# EasyEDA Pro project 智能台灯.epro

# Schematic STC15单片机台灯
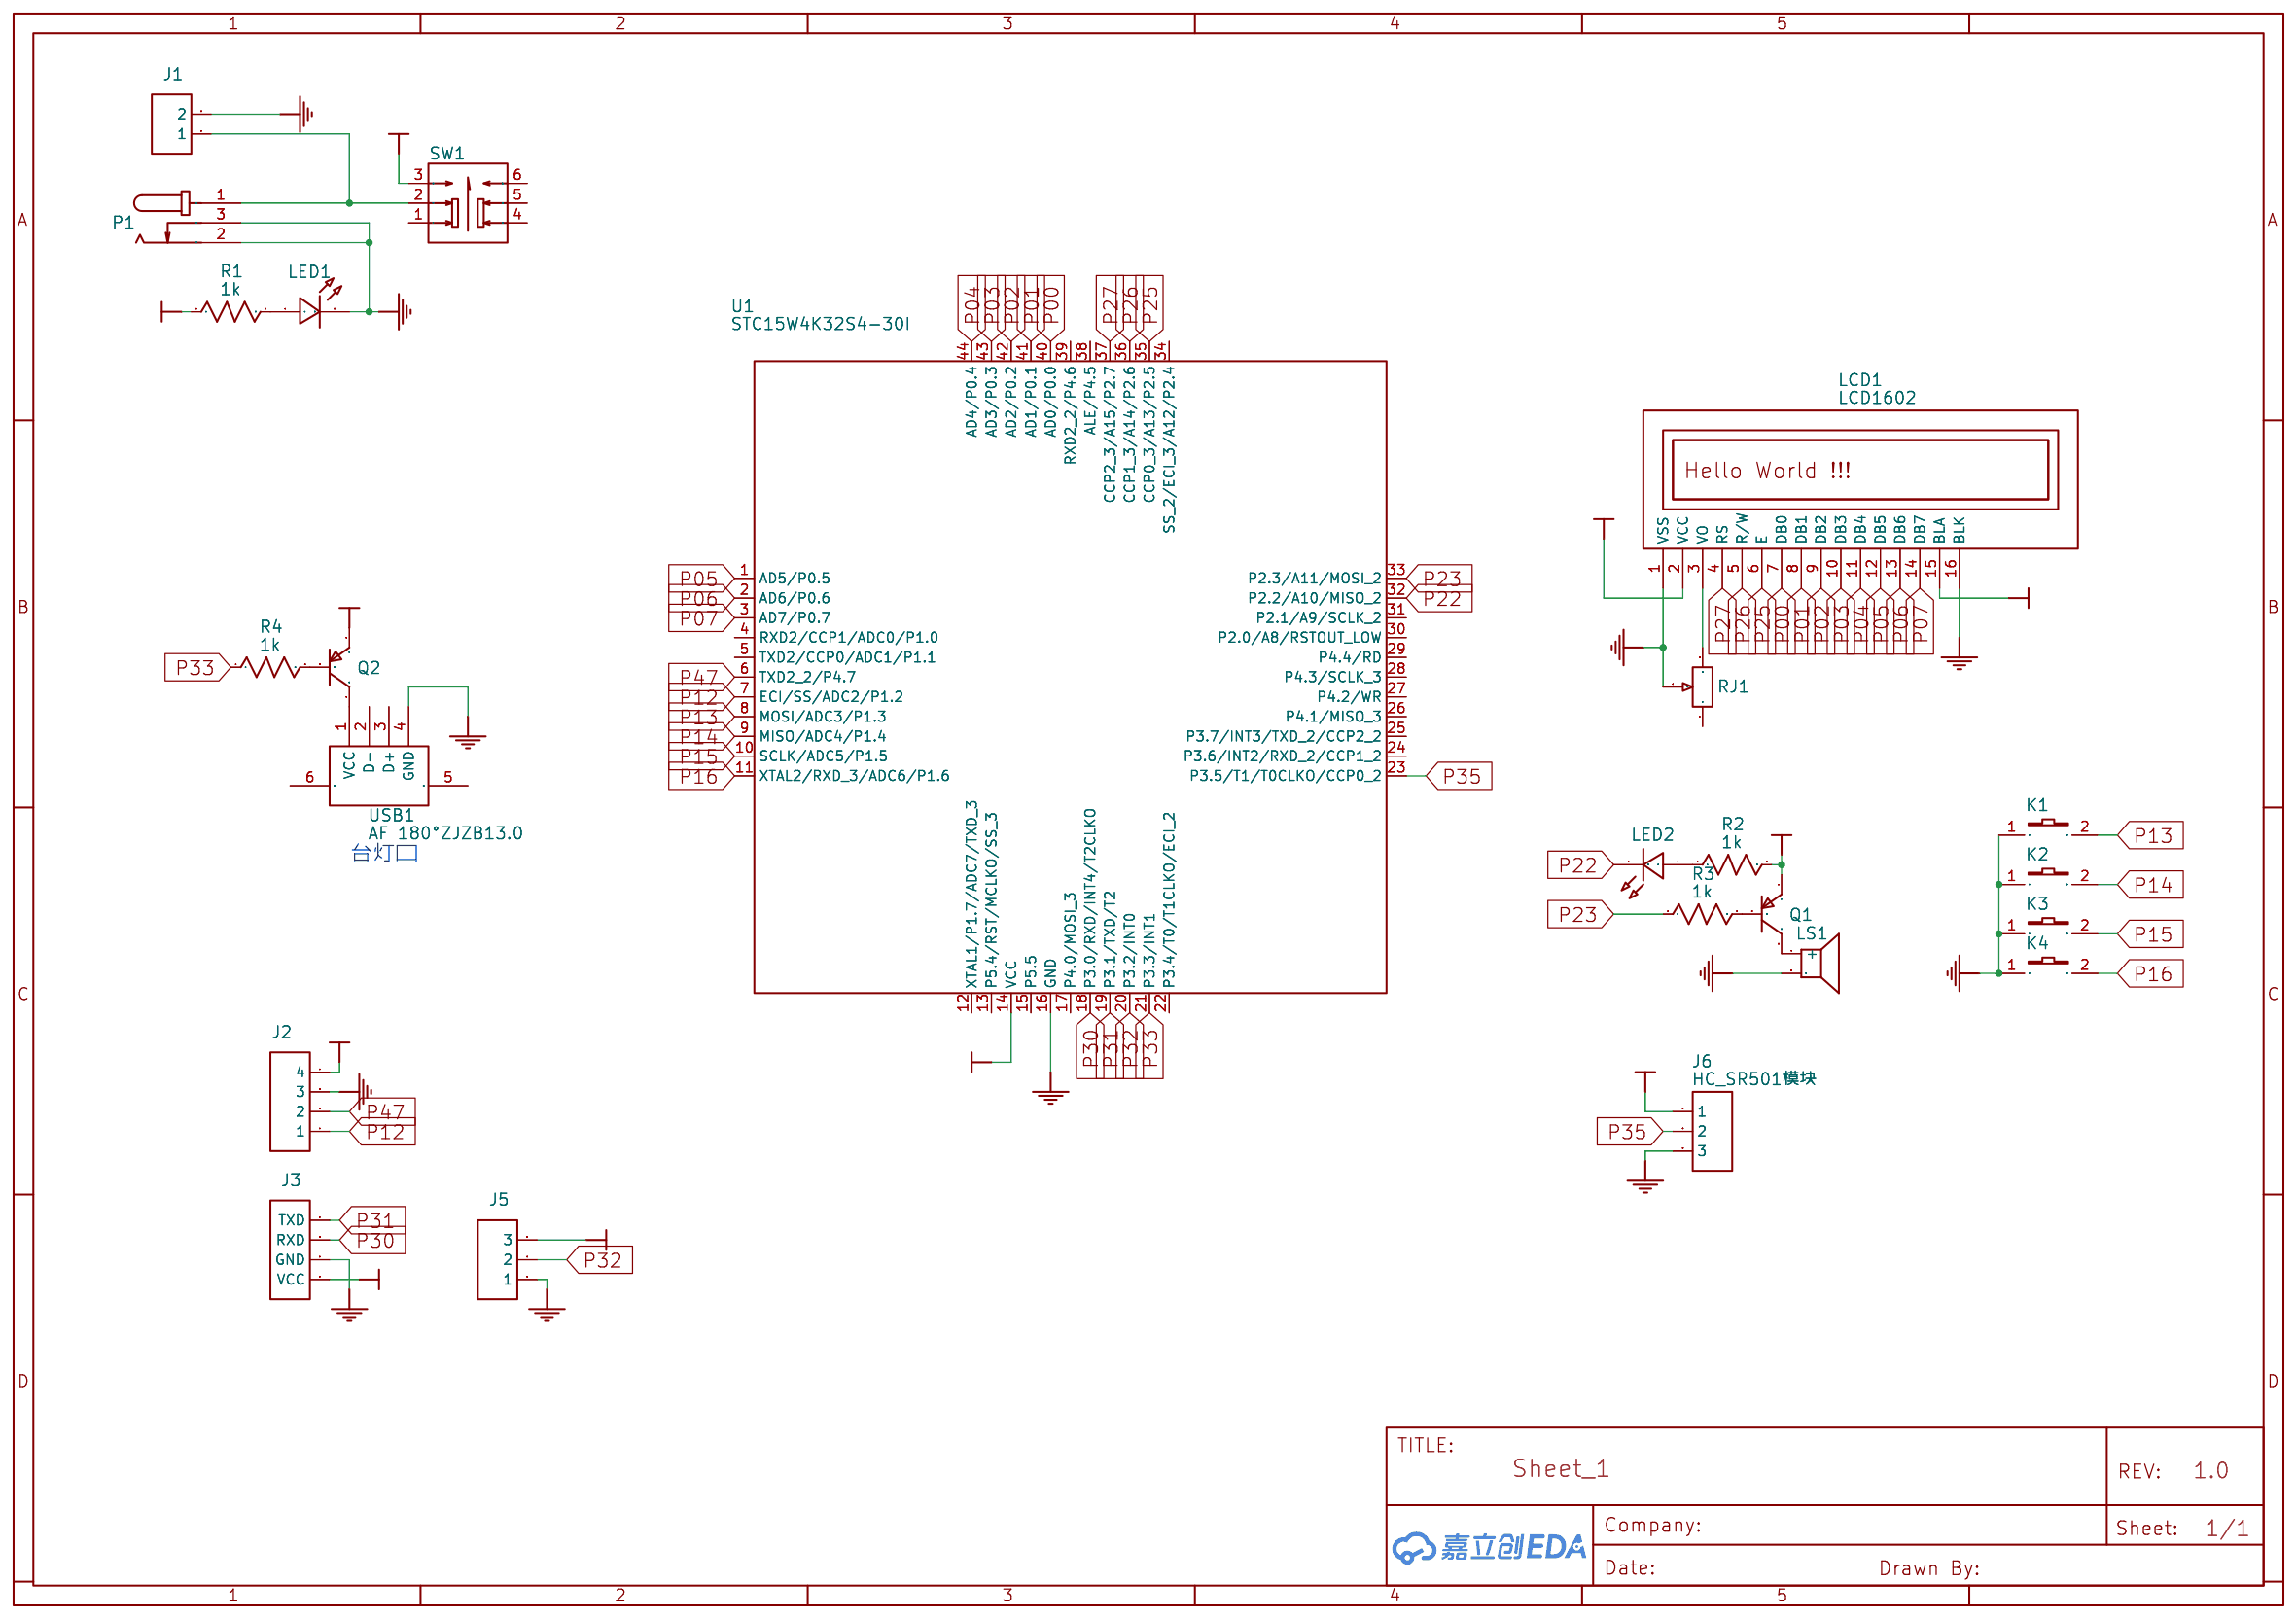
[diagram p0: schematic sheet]

## Parts
J1  HDR-F-2.54_1x2  [HDR-F-2.54_1X2]
J2  HDR-M-2.54_1x4  [HDR-M-2.54_1X4]
J3  HDR-F-2.54_1x4  [HDR-F-2.54_1X4]
J5  HDR-M-2.54_1x3  [HDR-M-2.54_1X3]
J6  HC_SR501模块  [HDR-M-2.54_1X3]
K1  K2-3.6×6.1_SMD  [BUTTON]
K2  K2-3.6×6.1_SMD  [BUTTON]
K3  K2-3.6×6.1_SMD  [BUTTON]
K4  K2-3.6×6.1_SMD  [BUTTON]
LCD1  LCD1602  [LCD1602]
LED1  LED-0603_R  [LED]
LED2  LED-0603_R  [LED]
LS1  YS-PBZ2316DYB12  [BUZZER-9MM]
P1  DC005-2.0MM  [POWER]
Q1  SS8550_C717456  [PNP]
Q2  SS8550_C717456  [PNP]
R1  1k  [RES]
R2  1k  [RES]
R3  1k  [RES]
R4  1k  [RES]
RJ1  微调立式蓝白电位器RM063-H1-10K  [__________]
SW1  PS-5850A-6PL  [SW-TH_6P-L5.8-W5.8-P2.00-LS4.5-BL_1]
U1  STC15W4K32S4-30I  [LQFP-44_L10.0-W10.0-P0.80-LS12.0-BL]
USB1  AF 180°ZJZB13.0  [USB-A-TH_USB-AF-13.7-180-PBT]

## Library data of the parts
J1 = HDR-F-2.54_1x2: Supplier Part: C49661; Supplier: LCSC
J2 = HDR-M-2.54_1x4: Supplier Part: C124378; Supplier: LCSC
J3 = HDR-F-2.54_1x4: Supplier Part: C225501; Supplier: LCSC
J5 = HDR-M-2.54_1x3: Supplier Part: C180248; Supplier: LCSC
J6 = HC_SR501模块: Supplier Part: C180248; Supplier: LCSC
K1-K4 = K2-1107ST-A4SW-06: Supplier Part: C118141; Supplier: LCSC; 制造商: 韩国韩荣
LCD1 = LCM1602K-NSW-BBW: Manufacturer: LONTECH(厦门龙特); Supplier Part: C83275; Supplier: LCSC
LED1 LED2 = 19-217/R6C-AL1M2VY/3T: Manufacturer: EVERLIGHT(台湾亿光); Supplier Part: C72044; Supplier: LCSC
LS1 = YS-PBZ2316DYB12: Supplier: LCSC; Supplier Part: C18337451; Manufacturer: Fengming(锋鸣电子)
P1 = DC005-2.0MM: Supplier: LCSC; Manufacturer: SOFNG; Supplier Part: C111567
Q1 Q2 = SS8550: Supplier: LCSC; Supplier Part: C717456; Manufacturer: LGE(鲁光); JLCPCB Part Class: Extended Part
R1-R4 = 1k
RJ1 = 微调立式蓝白电位器RM063-H1-10K: Supplier: LCSC; Supplier Part: C9900022631; Manufacturer: null; JLCPCB Part Class: Extended Part
SW1 = PS-5850A-6PL: Supplier: LCSC; Supplier Part: C963201; Manufacturer: G-Switch; JLCPCB Part Class: Extended Part
U1 = STC15W4K32S4-30I-LQFP44: Supplier: LCSC; Manufacturer: STC(宏晶); Supplier Part: C58472; JLCPCB Part Class: Extended Part
USB1 = AF 180°ZJZB13.0: Supplier: LCSC; Supplier Part: C6081370; Manufacturer: SHOU HAN(首韩); JLCPCB Part Class: Extended Part

## Nets
GND: J1.2 J2.3 J3.2(GND) J5.1 J6.3 K1.1 K2.1 K3.1 K4.1 LCD1.1(VSS) LCD1.16(BLK) LED1.2 LS1.2 P1.2 P1.3 RJ1.2 U1.16(GND) USB1.4(GND)
VCC: J2.4 J3.1(VCC) J5.3 J6.1 LCD1.2(VCC) LCD1.15(BLA) Q1.1(E) Q2.1(E) R1.1 R2.2 SW1.3 U1.14(VCC)
P00: LCD1.7(DB0) U1.40(AD0/P0.0)
P01: LCD1.8(DB1) U1.41(AD1/P0.1)
P02: LCD1.9(DB2) U1.42(AD2/P0.2)
P03: LCD1.10(DB3) U1.43(AD3/P0.3)
P04: LCD1.11(DB4) U1.44(AD4/P0.4)
P05: LCD1.12(DB5) U1.1(AD5/P0.5)
P06: LCD1.13(DB6) U1.2(AD6/P0.6)
P07: LCD1.14(DB7) U1.3(AD7/P0.7)
P12: J2.1 U1.7(ECI/SS/ADC2/P1.2)
P13: K1.2 U1.8(MOSI/ADC3/P1.3)
P14: K2.2 U1.9(MISO/ADC4/P1.4)
P15: K3.2 U1.10(SCLK/ADC5/P1.5)
P16: K4.2 U1.11(XTAL2/RXD_3/ADC6/P1.6)
P22: LED2.2 U1.32(P2.2/A10/MISO_2)
P23: R3.1 U1.33(P2.3/A11/MOSI_2)
P25: LCD1.6(E) U1.35(CCP0_3/A13/P2.5)
P26: LCD1.5(R/W) U1.36(CCP1_3/A14/P2.6)
P27: LCD1.4(RS) U1.37(CCP2_3/A15/P2.7)
P30: J3.3(RXD) U1.18(P3.0/RXD/INT4/T2CLKO)
P31: J3.4(TXD) U1.19(P3.1/TXD/T2)
P32: J5.2 U1.20(P3.2/INT0)
P33: R4.1 U1.21(P3.3/INT1)
P35: J6.2 U1.23(P3.5/T1/T0CLKO/CCP0_2)
P47: J2.2 U1.6(TXD2_2/P4.7)
LCD1_3: LCD1.3(VO) RJ1.3
LED2_1: LED2.1 R2.1
LS1_1: LS1.1(+) Q1.3(C)
P1_1: J1.1 P1.1 SW1.2
Q1_2: Q1.2(B) R3.2
Q2_2: Q2.2(B) R4.2
Q2_3: Q2.3(C) USB1.1(VCC)
R1_2: LED1.1 R1.2

Not connected (* = marked no-connect by the designer): RJ1 1; SW1 1 4 5 6; U1 4(RXD2/CCP1/ADC0/P1.0) 5(TXD2/CCP0/ADC1/P1.1) 12(XTAL1/P1.7/ADC7/TXD_3) 13(P5.4/RST/MCLKO/SS_3) 15(P5.5) 17(P4.0/MOSI_3) 22(P3.4/T0/T1CLKO/ECI_2) 24(P3.6/INT2/RXD_2/CCP1_2) 25(P3.7/INT3/TXD_2/CCP2_2) 26(P4.1/MISO_3) 27(P4.2/WR) 28(P4.3/SCLK_3) 29(P4.4/RD) 30(P2.0/A8/RSTOUT_LOW) 31(P2.1/A9/SCLK_2) 34(SS_2/ECI_3/A12/P2.4) 38(ALE/P4.5) 39(RXD2_2/P4.6); USB1 2(D-) 3(D+) 5 6

## Notes on the sheet
- 台灯口

# Board PCB_PCB_STC15单片机路灯控制系统_2025-12-27
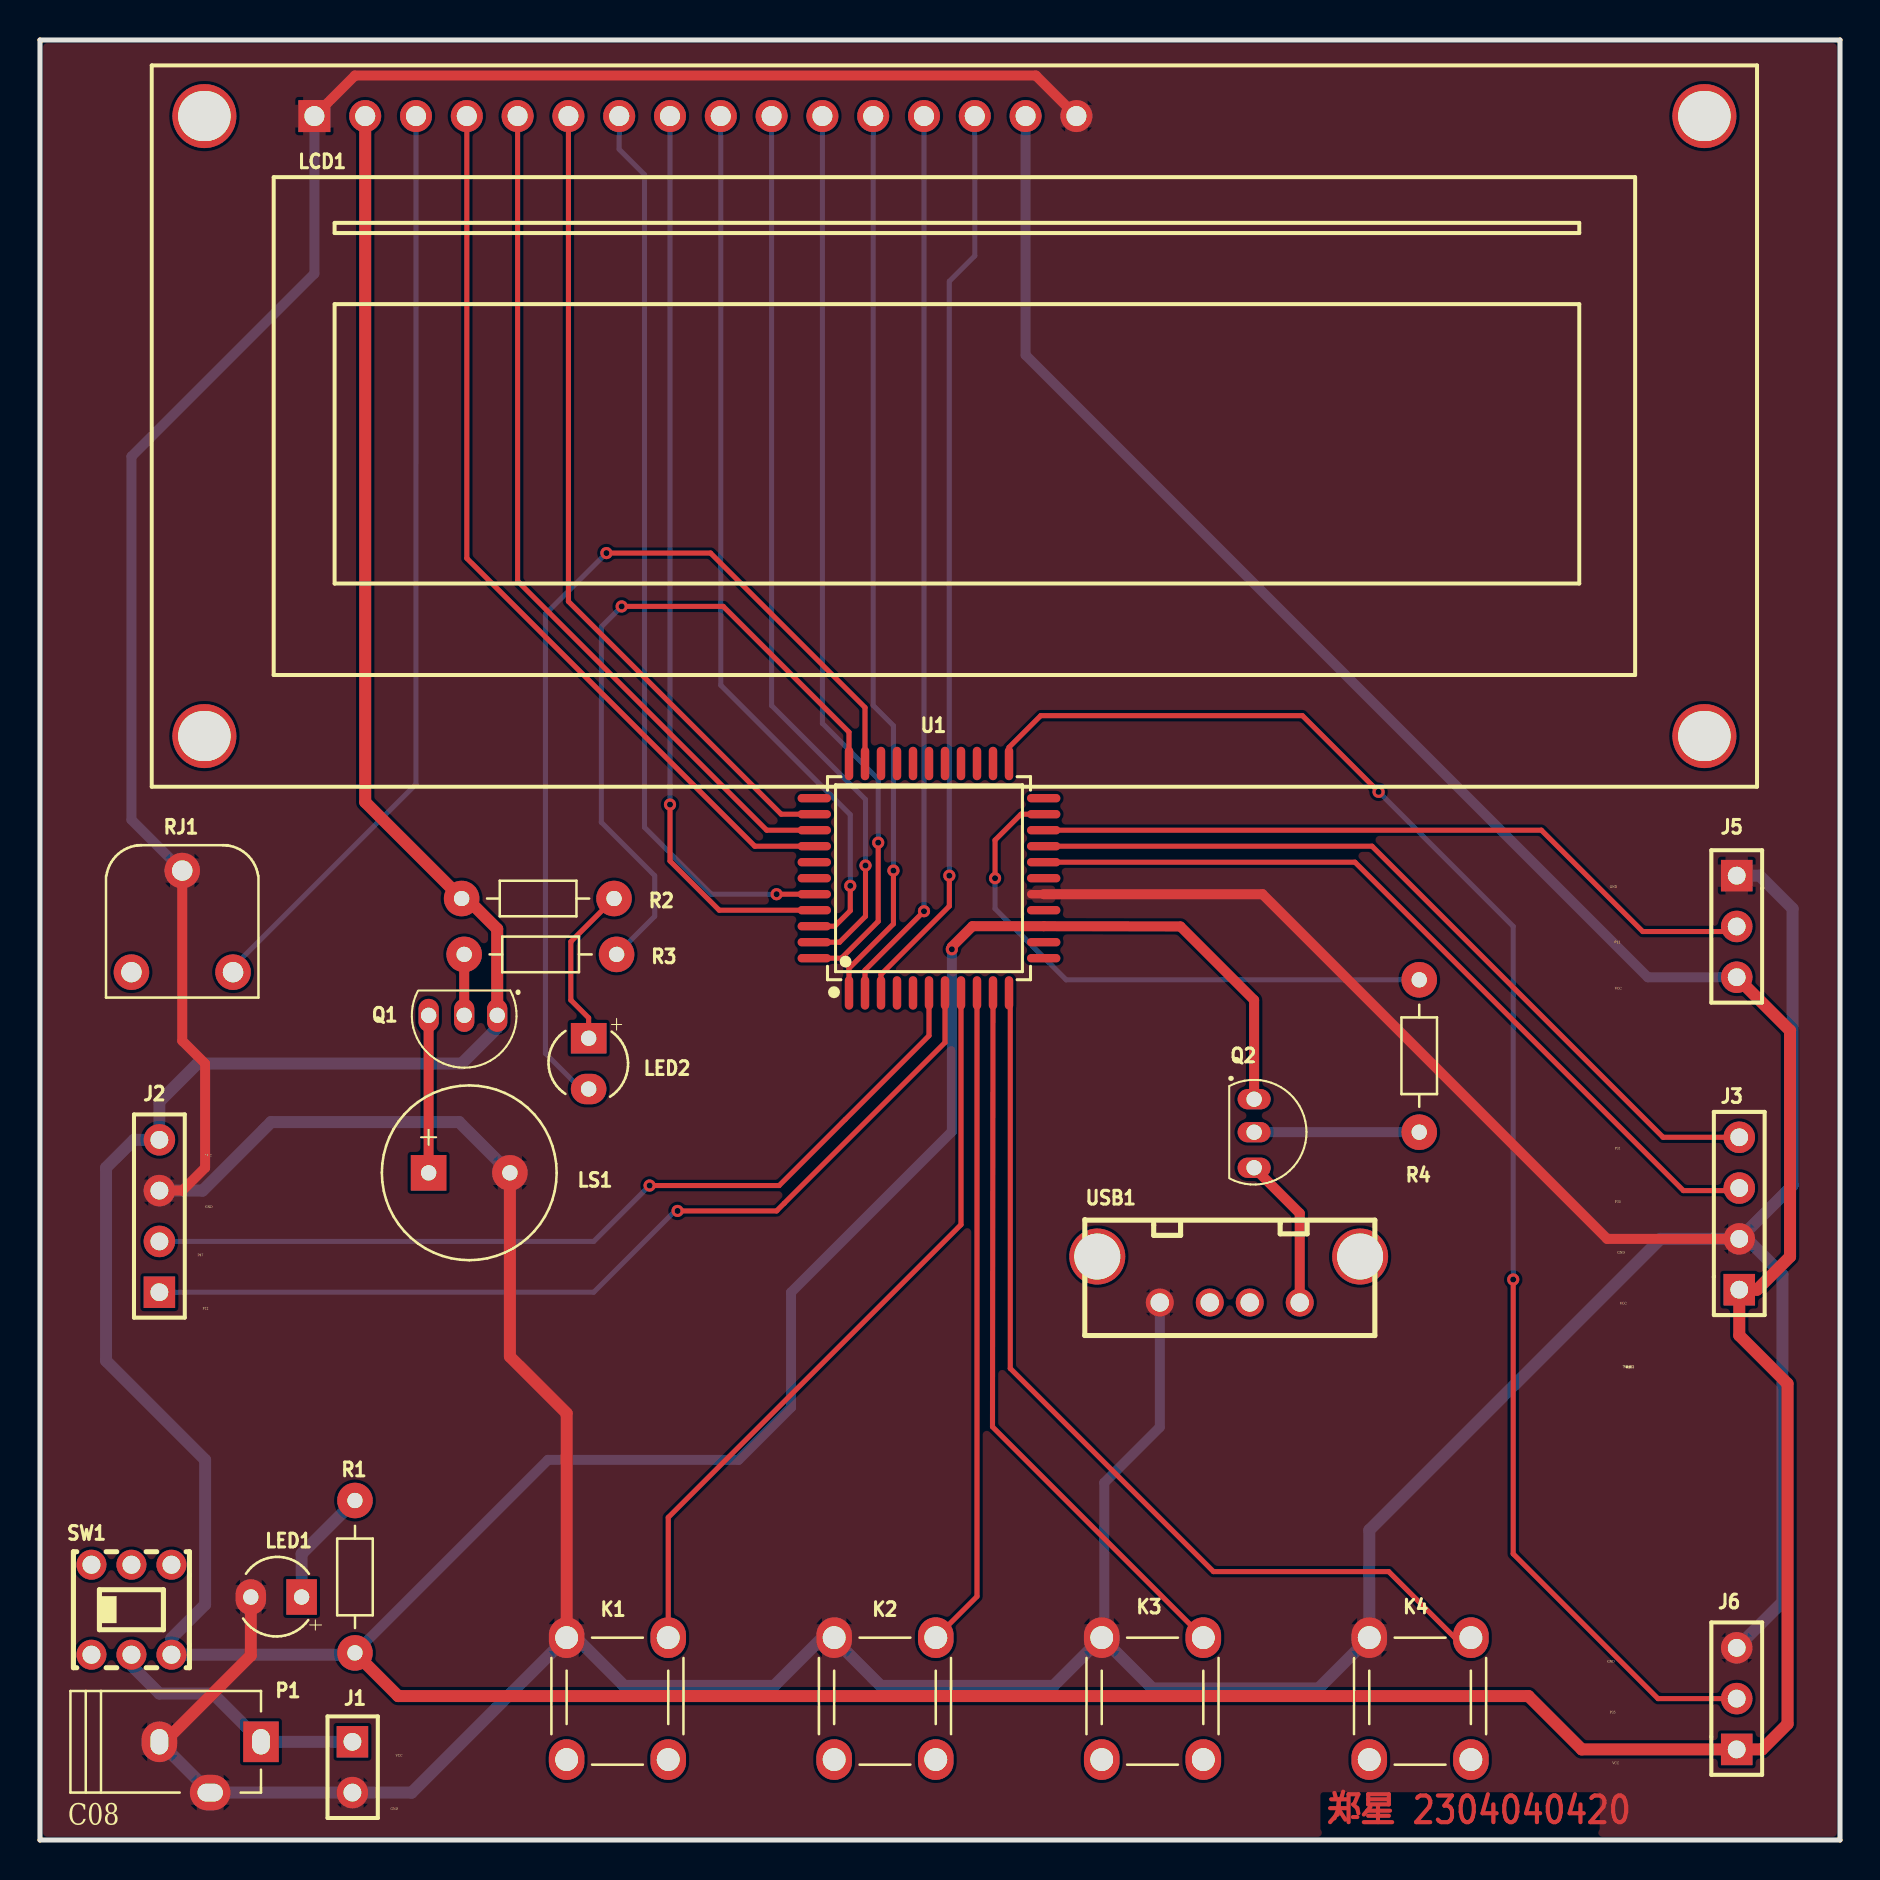
[diagram p1: board, top side]
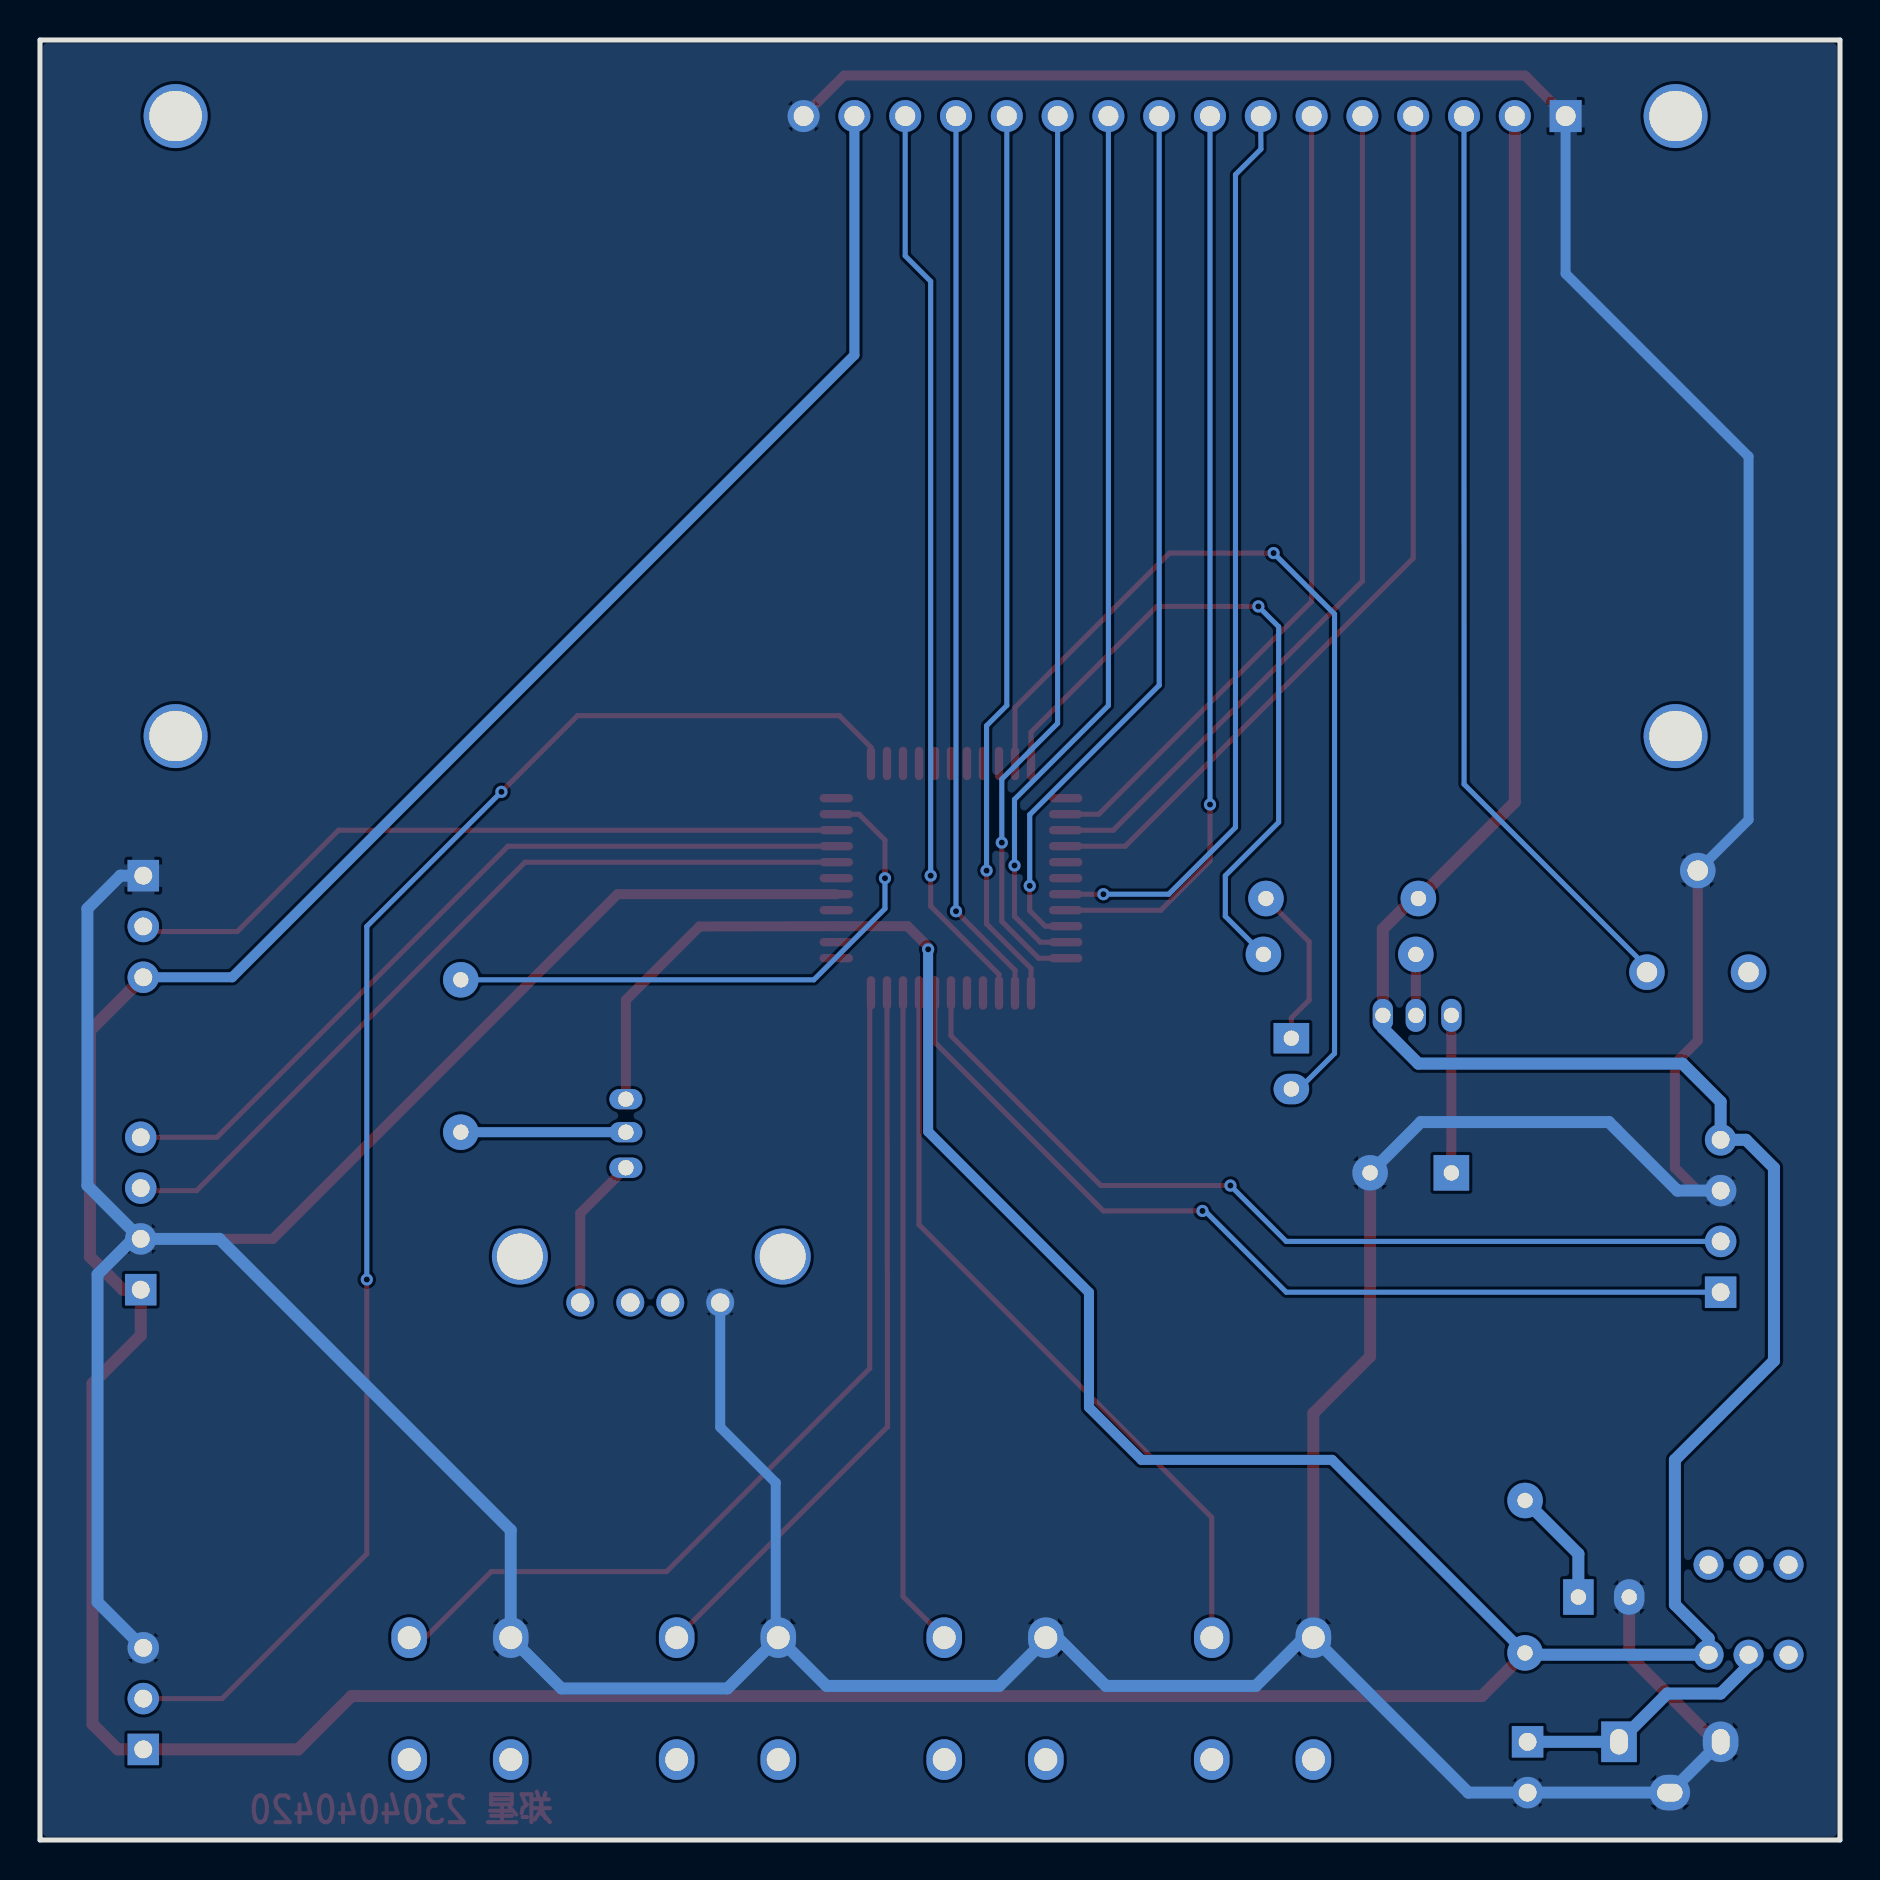
[diagram p2: board, bottom side, seen from below]

Outline 90 x 90 mm; copper layers: Top Layer, Bottom Layer. Coordinates in mm from the lower left corner of the outline.
Outline path: 0,90 90,90 90,0 0,0 0,90
Stack: Top Layer 0.035mm / Bottom Layer 0.035mm

## Design rules (mm)
spacing Default (default): track to track 0.102, other pairs 0 to 0.3
track width Default (default): min 0.254, default 0.254, max 25.4
differential pair differentialPair (default): width min 0.127, default 2.54, max 2.54; gap min 0.127, default 0.152

## Placement (name value [footprint] x y rotation side)
J1  HDR-F-2.54_1x2  [HDR-F-2.54_1X2]  15.62 3.64 270 top
J2  HDR-M-2.54_1x4  [HDR-M-2.54_1X4]  5.97 31.2 90 top
J3  HDR-F-2.54_1x4  [HDR-F-2.54_1X4]  84.96 31.33 90 top
J5  HDR-M-2.54_1x3  [HDR-M-2.54_1X3]  84.84 45.68 270 top
J6  HC_SR501模块  [HDR-M-2.54_1X3]  84.84 7.07 90 top
K1  K2-3.6×6.1_SMD  [BUTTON]  26.33 9.61 0 top
K2  K2-3.6×6.1_SMD  [BUTTON]  39.71 9.61 0 top
K3  K2-3.6×6.1_SMD  [BUTTON]  53.09 9.61 0 top
K4  K2-3.6×6.1_SMD  [BUTTON]  66.46 9.61 0 top
LCD1  -  [LCD1602]  45.72 70.7 0 top
LED1  LED-0603_R  [LED]  13.08 12.15 180 top
LED2  LED-0603_R  [LED]  27.43 40.09 270 top
LS1  YS-PBZ2316DYB12  [BUZZER-9MM]  19.43 32.09 0 top
P1  DC005-2.0MM  [POWER]  11.05 4.91 270 top
Q1  SS8550_C717456  [PNP]  22.73 41.23 180 top
Q2  SS8550_C717456  [PNP]  60.71 36.91 270 top
R1  1k  [RES]  14.48 8.09 90 top
R2  1k  [RES]  29.97 45.8 180 top
R3  1k  [RES]  30.1 43.01 180 top
R4  1k  [RES#2]  57.53 44.28 270 top
RJ1  微调立式蓝白电位器RM063-H1-10K  [__________]  4.57 43.39 0 top
SW1  PS-5850A-6PL  [SW-TH_6P-L5.8-W5.8-P2.00-LS4.5-BL_1]  4.57 11.51 0 top
U1  STC15W4K32S4-30I  [LQFP-44_L10.0-W10.0-P0.80-LS12.0-BL]  44.45 48.09 0 top
USB1  AF 180°ZJZB13.0  [USB-A-TH_USB-AF-13.7-180-PBT]  59.44 28.02 270 top

## Footprints (pads in the part's own frame, mm; a bottom-side part is the same pattern mirrored in y, then rotated)
__________
  round 1.778 hole 1.021x1.016: 1(0,0) 2(2.54,5.08) 3(5.08,0)
BUTTON
  oval 1.778x2.032 hole 1.143x1.148: 1(0,0.508) 2(5.08,0.508) 3(5.08,-5.588) 4(0,-5.588)
BUZZER-9MM
  rect 1.778x1.778 hole 0.767x0.762: 1(0,1.27)
  round 1.778 hole 0.767x0.762: 2(4.064,1.27)
HDR-F-2.54_1X2
  rect 1.575x1.575 hole 0.889: 1(-1.27,0)
  round 1.575 hole 0.889: 2(1.27,0)
HDR-F-2.54_1X4
  rect 1.575x1.575 hole 0.889: 1(-3.81,0)
  round 1.575 hole 0.889: 2(-1.27,0) 3(1.27,0) 4(3.81,0)
HDR-M-2.54_1X3
  rect 1.575x1.575 hole 0.889: 1(-2.54,0)
  round 1.575 hole 0.889: 2(0,0) 3(2.54,0)
HDR-M-2.54_1X4
  rect 1.575x1.575 hole 0.889: 1(-3.81,0)
  round 1.575 hole 0.889: 2(-1.27,0) 3(1.27,0) 4(3.81,0)
LCD1602
  round 3.2 hole 2.625x2.5: 0(-37.5,15.5) 0(-37.5,-15.5) 0(37.5,15.5) 0(37.5,-15.5)
  rect 1.6x1.6 hole 1: 1(-32,15.5)
  round 1.6 hole 1: 2(-29.46,15.5) 3(-26.92,15.5) 4(-24.38,15.5) 5(-21.84,15.5) 6(-19.3,15.5) 7(-16.76,15.5) 8(-14.22,15.5) 9(-11.68,15.5) 10(-9.14,15.5) 11(-6.6,15.5) 12(-4.06,15.5) 13(-1.52,15.5) 14(1.02,15.5) 15(3.56,15.5) 16(6.1,15.5)
LED
  rect 1.524x1.778 hole 0.762x0.767: 1(0,0)
  oval 1.524x1.778 hole 0.762x0.767: 2(2.54,0)
LQFP-44_L10.0-W10.0-P0.80-LS12.0-BL
  oval 0.42x1.67 smd: 1(-4,-5.735) 2(-3.2,-5.735) 3(-2.4,-5.735) 4(-1.6,-5.735) 5(-0.8,-5.735) 6(0,-5.735) 7(0.8,-5.735) 8(1.6,-5.735) 9(2.4,-5.735) 10(3.2,-5.735) 11(4,-5.735) 23(4,5.735) 24(3.2,5.735) 25(2.4,5.735) 26(1.6,5.735) 27(0.8,5.735) 28(0,5.735) 29(-0.8,5.735) 30(-1.6,5.735) 31(-2.4,5.735) 32(-3.2,5.735) 33(-4,5.735)
  oval 1.67x0.42 smd: 12(5.735,-4) 13(5.735,-3.2) 14(5.735,-2.4) 15(5.735,-1.6) 16(5.735,-0.8) 17(5.735,0) 18(5.735,0.8) 19(5.735,1.6) 20(5.735,2.4) 21(5.735,3.2) 22(5.735,4) 34(-5.735,4) 35(-5.735,3.2) 36(-5.735,2.4) 37(-5.735,1.6) 38(-5.735,0.8) 39(-5.735,0) 40(-5.735,-0.8) 41(-5.735,-1.6) 42(-5.735,-2.4) 43(-5.735,-3.2) 44(-5.735,-4)
PNP
  oval 1.016x1.651 hole 0.762x0.767: 1(-0.127,0) 2(1.524,0) 3(3.302,0)
POWER
  rect 2.032x1.778 hole 1.27x0.889: 1(0,0)
  oval 2.032x1.778 hole 1.27x0.889: 2(0,-5.08)
  oval 1.778x2.032 hole 0.889x1.27: 3(2.54,-2.54)
RES
  round 1.778 hole 0.767x0.762: 1(1.27,-1.27) 2(8.89,-1.27)
RES#2
  round 1.778 hole 0.767x0.762: 1(1.27,11.43) 2(8.89,11.43)
SW-TH_6P-L5.8-W5.8-P2.00-LS4.5-BL_1
  round 1.5 hole 0.9: 1(-2,-2.25) 2(0,-2.25) 3(2,-2.25) 4(-2,2.25) 5(0,2.25) 6(2,2.25)
USB-A-TH_USB-AF-13.7-180-PBT
  round 1.4 hole 0.92: 1(1.15,3.551) 2(1.15,1.052) 3(1.15,-0.948) 4(1.15,-3.446)
  round 2.8 hole 2.3: 5(-1.15,-6.571) 6(-1.15,6.571)

## Nets
As in the schematic.

Pads without a net: K1 3 4; K2 3 4; K3 3 4; K4 3 4; LCD1 0

## Via types
v1: diameter 0.61, hole 0.305, Top Layer to Bottom Layer, 16 vias

## Routing (per net, layer and track width the routed paths; a pad name or vN(x,y) marks a point on that pad's centre or on a via; arc(x,y) is an arc through that point)
GND: length 358.4
  Top Layer w0.5: J2.3 7.11,32.47 8.25,33.61 8.25,38.82 7.11,39.96 RJ1.2 ; U1.16 61.12,47.29 78.36,30.06 J3.2 ; LCD1.1 15.75,88.22 49.79,88.22 LCD1.16
  Top Layer w0.6: LED1.2 10.54,9.23 6.22,4.91 P1.2 ; LS1.2 23.49,24.17 26.33,21.34 K1.1
  Bottom Layer w0.5: RJ1.2 4.57,51.01 4.57,69.17 13.72,78.32 LCD1.1 ; K3.1 53.21,10.24 53.21,17.86 55.99,20.64 55.99,26.87
  Bottom Layer w0.6: LS1.2 20.95,35.9 11.56,35.9 8.13,32.47 J2.3 ; J3.2 85.34,30.06 87.12,28.28 87.12,11.9 84.84,9.61 ; J3.2 87.63,32.72 87.63,46.57 85.98,48.22 J5.1 ; J3.2 81.03,30.06 66.46,15.49 K4.1 63.92,7.58 55.63,7.58 K3.1 50.67,7.7 42.04,7.7 39.71,10.03 K2.1 39.12,10.12 36.7,7.7 29.21,7.7 26.8,10.12 K1.1 18.58,2.37 J1.2 P1.3 P1.2
VCC: length 359.3
  Top Layer w0.5: U1.14 46.62,45.69 45.59,44.66 v1(45.59,44.53) ; 50.19,45.69 57.02,45.68 60.71,41.99 Q2.1
  Top Layer w0.6: LCD1.2 16.26,51.9 R2.2 21.21,47.2 22.86,45.55 Q1.1 ; 15.75,9.35 17.91,7.2 74.42,7.2 77.09,4.53 J6.1 86.11,4.53 87.38,5.8 87.38,22.82 84.96,25.23 J3.1 85.85,27.52 87.5,29.17 87.5,40.47 84.84,43.14
  Bottom Layer w0.5: 84.84,43.14 80.39,43.14 49.28,74.25 LCD1.15 ; v1(45.59,44.53) 45.59,35.42 37.55,27.38 37.55,21.63 34.92,19.01 25.4,19.01 15.75,9.35
  Bottom Layer w0.6: Q1.1 22.86,40.6 21.08,38.82 7.87,38.82 5.97,36.91 J2.4 4.7,35.01 3.3,33.61 3.3,23.96 8.25,19.01 8.25,11.77 6.57,10.08 SW1.3 15.66,9.26 15.75,9.35
LCD1_3: length 46.6
  Bottom Layer w0.254: 18.8,86.19 18.8,52.79 9.65,43.64 RJ1.3
LED2_1: length 8.2
  Top Layer w0.254: LED2.1 27.43,41.11 26.54,41.99 26.54,44.91 R2.1
LS1_1: length 7.9
  Top Layer w0.5: 19.43,41.23 LS1.1
P00: length 46
  Top Layer w0.254: 38.72,47.29 v1(36.83,47.29)
  Bottom Layer w0.254: v1(36.83,47.29) 33.57,47.29 30.23,50.63 30.23,83.27 28.96,84.54 28.96,86.19
P01: length 45.5
  Top Layer w0.254: U1.41 33.96,46.49 31.5,48.95 v1(31.5,51.77)
  Bottom Layer w0.254: LCD1.8 v1(31.5,51.77)
P1_1: length 13.2
  Bottom Layer w0.6: SW1.2 4.57,8.72 5.97,7.32 8.64,7.32 P1.1 J1.1
P02: length 44.5
  Top Layer w0.254: v1(40.51,47.71) 40.51,46.46 39.74,45.69 38.72,45.69
  Bottom Layer w0.254: LCD1.9 34.04,57.74 40.51,51.27 v1(40.51,47.71)
P03: length 45.1
  Top Layer w0.254: U1.43 39.98,44.89 41.28,46.19 v1(41.28,48.72)
  Bottom Layer w0.254: v1(41.28,48.72) 41.28,52.03 36.58,56.72 LCD1.10
P04: length 45.4
  Top Layer w0.254: v1(41.91,49.87) 41.91,45.93 40.07,44.09 38.72,44.09
  Bottom Layer w0.254: LCD1.11 39.12,55.83 41.91,53.04 v1(41.91,49.87)
P05: length 45.2
  Top Layer w0.254: v1(42.67,48.47) 42.67,45.8 40.45,43.58 U1.1
  Bottom Layer w0.254: v1(42.67,48.47) 42.67,55.71 41.66,56.73 LCD1.12
P06: length 45.1
  Top Layer w0.254: v1(44.2,46.44) 41.25,43.49 U1.2
  Bottom Layer w0.254: LCD1.13 v1(44.2,46.44)
P07: length 45.8
  Top Layer w0.254: U1.3 42.05,43.28 45.47,46.69 v1(45.47,48.22)
  Bottom Layer w0.254: LCD1.14 46.74,79.21 45.47,77.94 v1(45.47,48.22)
P12: length 46.9
  Top Layer w0.254: v1(31.88,31.45) 36.83,31.45 45.25,39.87 U1.7
  Bottom Layer w0.254: J2.1 27.69,27.39 31.75,31.45 v1(31.88,31.45)
P13: length 38.3
  Top Layer w0.254: K1.2 31.41,16.13 46.05,30.77 U1.8
P14: length 33.1
  Top Layer w0.254: K2.2 46.85,12.18 U1.9
P15: length 36.6
  Top Layer w0.254: U1.10 47.62,20.66 K3.2
P16: length 47.4
  Top Layer w0.254: K4.2 70.74,10.12 67.44,13.42 58.67,13.42 48.51,23.58 48.51,42.29 U1.11
P22: length 48.1
  Top Layer w0.254: v1(28.32,64.35) 33.53,64.35 41.25,56.62 U1.32
  Bottom Layer w0.254: LED2.2 27.05,37.55 25.27,39.33 25.27,61.3 v1(28.32,64.35)
P23: length 35.3
  Top Layer w0.254: U1.33 40.45,55.39 34.16,61.68 v1(29.08,61.68)
  Bottom Layer w0.254: 28.83,44.28 30.73,46.19 30.73,48.22 28.07,50.88 28.07,60.66 v1(29.08,61.68)
P25: length 41
  Top Layer w0.254: 26.42,86.19 26.42,61.93 37.06,51.29 U1.35
P26: length 43.2
  Top Layer w0.254: 23.88,86.19 23.88,62.94 36.33,50.49 U1.36
P27: length 45.4
  Top Layer w0.254: 21.34,86.19 21.34,64.09 35.74,49.69 U1.37
P30: length 41.6
  Top Layer w0.254: J3.3 84.84,32.47 82.17,32.47 65.75,48.89 50.19,48.89
P31: length 40.8
  Top Layer w0.254: J3.4 81.15,35.14 66.6,49.69 50.19,49.69
P32: length 36.9
  Top Layer w0.254: U1.20 75.07,50.49 80.14,45.42 84.58,45.42 J5.2
P33: length 29.1
  Top Layer w0.254: U1.21 49.05,51.29 47.75,50 v1(47.75,48.09)
  Bottom Layer w0.254: 68.96,43.01 51.31,43.01 47.75,46.57 v1(47.75,48.09)
P35: length 76.6
  Top Layer w0.254: U1.23 48.45,54.63 50.04,56.22 63.12,56.22 v1(66.93,52.41) ; v1(73.66,28.02) 73.66,14.31 80.9,7.07 J6.2
  Bottom Layer w0.254: v1(73.66,28.02) 73.66,45.68 v1(66.93,52.41)
P47: length 44.9
  Top Layer w0.254: U1.6 44.45,40.22 36.96,32.72 v1(30.48,32.72)
  Bottom Layer w0.254: v1(30.48,32.72) 27.69,29.93 J2.2
Q1_2: length 3
  Top Layer w0.5: Q1.2 R3.2
Q2_2: length 8.3
  Bottom Layer w0.5: 68.96,35.39 Q2.2
Q2_3: length 7.7
  Top Layer w0.5: Q2.3 62.99,31.33 62.99,26.87
R1_2: length 5.9
  Bottom Layer w0.6: 15.75,16.97 13.08,14.31 LED1.1

## Copper pours and planes (outline as drawn; the poured copper is in the pictures)
GND on Top Layer: -0.51,90.13 0.13,90.76 91.57,90.76 91.69,90.63 91.69,-3.09 90.55,-1.95 -2.29,-1.95 -1.4,-1.06 -1.4,90.76 -0.89,90.25 -0.76,90.25
GND on Bottom Layer: 91.95,90.38 91.95,-1.95 91.57,-1.57 -1.4,-1.57 -1.65,-1.31 -1.65,91.27 -1.4,91.27 -0.76,90.63 91.69,90.63

## Text on the board
Top Layer: 郑星 2304040420
Top Silkscreen Layer: 下载接口 | P47 | P12 | VCC | GND | P35 | P32 | P31 | P30 | C08
